# EAGLE design ISO-UART v0.1 (EAGLE 7.7.0)
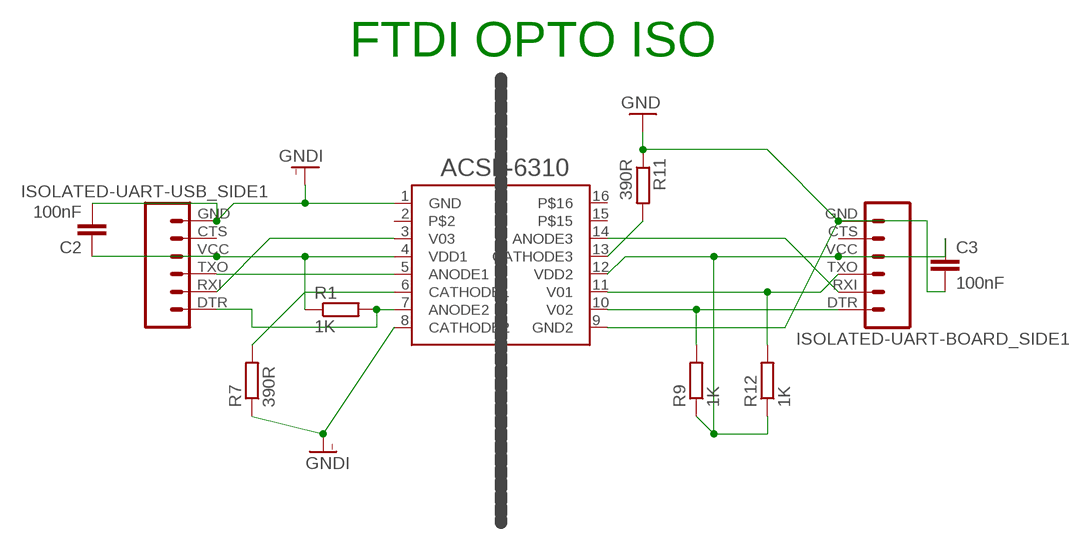
[diagram p0: schematic, sheet 1]

## Parts
ACSL-6310  ACSL-6310  [SO16]
C2  100nF  C-EUC0603  [C0603]
C3  100nF  C-EUC0603  [C0603]
ISOLATED-UART-BOARD_SIDE1  2211S-06G  FTDI_BASICPTH  [FTDI_BASIC]
ISOLATED-UART-USB_SIDE1  2211S-06G  FTDI_BASICPTH  [FTDI_BASIC]
R1  1K  R-EU_R0603  [R0603]
R7  390R  R-EU_R0603  [R0603]
R9  1K  R-EU_R0603  [R0603]
R11  390R  R-EU_R0603  [R0603]
R12  1K  R-EU_R0603  [R0603]

## Nets
GND [thin_power]: ACSL-6310.9(GND2) C3.2 ISOLATED-UART-BOARD_SIDE1.GND R11.1
GNDI [thin_power]: ACSL-6310.1(GND) ACSL-6310.8(CATHODE2) C2.2 ISOLATED-UART-USB_SIDE1.GND R7.1
N$2: ACSL-6310.4(VDD1) C2.1 ISOLATED-UART-USB_SIDE1.VCC R1.1
N$3: ACSL-6310.5(ANODE1) ISOLATED-UART-USB_SIDE1.TXO
N$4: ACSL-6310.7(ANODE2) ISOLATED-UART-USB_SIDE1.DTR R1.2
N$5: ACSL-6310.3(V03) ISOLATED-UART-USB_SIDE1.RXI
N$7: ACSL-6310.10(V02) ISOLATED-UART-BOARD_SIDE1.DTR R9.2
N$8 [thin_power]: ACSL-6310.12(VDD2) C3.1 ISOLATED-UART-BOARD_SIDE1.VCC R9.1 R12.1
N$9: ACSL-6310.14(ANODE3) ISOLATED-UART-BOARD_SIDE1.RXI
N$12: ACSL-6310.6(CATHODE1) R7.2
N$16: ACSL-6310.13(CATHODE3) R11.2
N$18: ACSL-6310.11(V01) ISOLATED-UART-BOARD_SIDE1.TXO R12.2
Unconnected: ACSL-6310.2 ACSL-6310.15 ACSL-6310.16 ISOLATED-UART-BOARD_SIDE1.CTS ISOLATED-UART-USB_SIDE1.CTS

## Notes on the sheet
- FTDI OPTO ISO
- ACSL-6310

## Library data of the parts
ACSL-6310 = PACKAGES FOR TEST BOARDS:ACSL-6310
C2 C3 = rcl:C-EU: CAPACITOR, European symbol
ISOLATED-UART-BOARD_SIDE1 ISOLATED-UART-USB_SIDE1 = SparkFun:FTDI_BASIC: FTDI Basic: 3.3V and 5V; MF: MULTICOMP; MPN: 2211S-06G; OC_FARNELL: 1593415
R1 R7 R9 R11 R12 = rcl:R-EU_: RESISTOR, European symbol

## Net classes
2 thin_power: width 0.254 mm

## Board
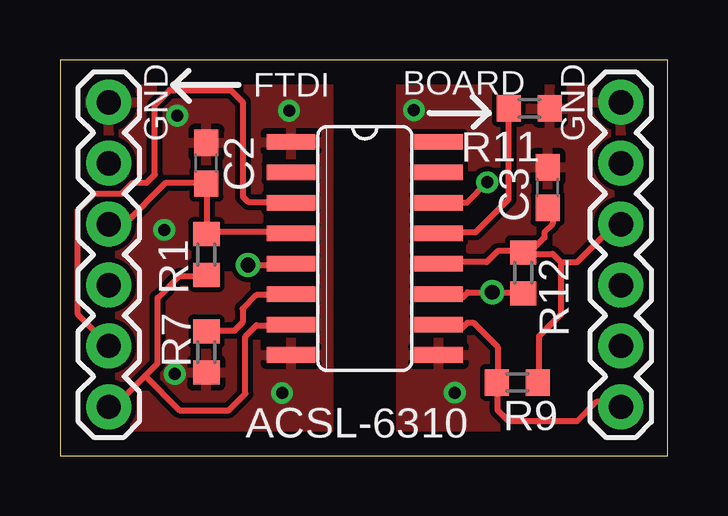
[diagram p1: board, top side]
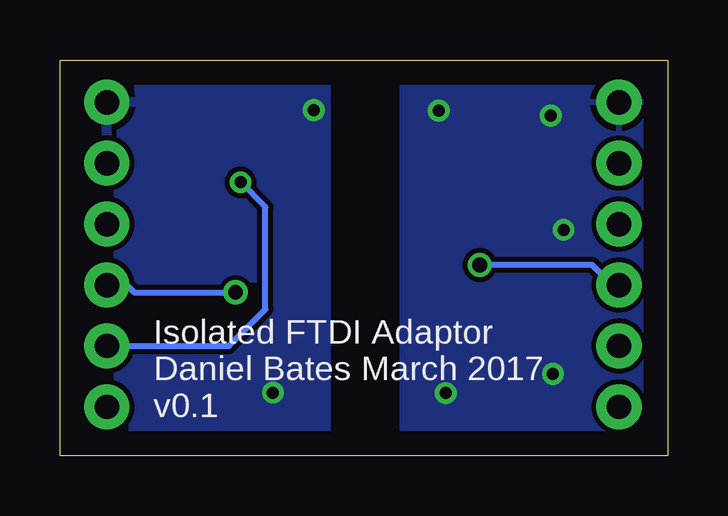
[diagram p2: board, bottom side, seen from below]

Size 25.32 x 16.5 mm. Coordinates in mm from the lower left corner, seen from the top.
Outline: 0,0 25.32,0 25.32,16.5 0,16.5 0,0
Copper layers (1*16): Top 0.035mm / dielectric 1.5mm / Bottom 0.035mm
Design rules "default": minimum track width 10mil, minimum drill 24mil, track to track 8mil, track to pad 8mil, pad to pad 8mil, via to via 8mil, smd to smd 8mil, copper to edge 40mil, drill to drill 8mil, minimum pad ring 10mil, minimum via ring 8mil, stop-mask expansion 4mil, vias tented up to drill 0mil, thermal gap 10mil

### Footprints (pad centres in the part's own frame; a part is rotated, then mirrored left to right if it is on the bottom)
SO16 = smd 0.66 x 2.032: 1 -4.445,-3.073; 2 -3.175,-3.073; 3 -1.905,-3.073; 4 -0.635,-3.073; 5 0.635,-3.073; 6 1.905,-3.073; 7 3.175,-3.073; 8 4.445,-3.073; 9 4.445,3.073; 10 3.175,3.073; 11 1.905,3.073; 12 0.635,3.073; 13 -0.635,3.073; 14 -1.905,3.073; 15 -3.175,3.073; 16 -4.445,3.073
C0603 = smd 1.1 x 1: 1 -0.85,0; 2 0.85,0
FTDI_BASIC = drill 1.016 pad 1.88: CTS 10.16,0; DTR 0,0; GND 12.7,0; RXI 2.54,0; TXO 5.08,0; VCC 7.62,0
R0603 = smd 1 x 1.1: 1 -0.85,0; 2 0.85,0

### Placement (x,y rotation side)
ACSL-6310  12.7,8.64 270 top
C2  6.1,12.19 90 top
C3  20.32,11.18 90 top
ISOLATED-UART-BOARD_SIDE1  23.37,2.03 90 top
ISOLATED-UART-USB_SIDE1  2.03,2.03 90 top
R1  6.1,8.38 270 top
R7  6.1,4.32 90 top
R9  19.05,3.05 180 top
R11  19.56,14.48 180 top
R12  19.3,7.62 270 top

### Tracks (layer width: path | path; a pad name or v marks a point on that pad's centre or on a via)
GND  (via drill 0.5)
  other vias: 14.75,14.41 16.45,2.62
  pour Bottom: 14.22,-0.51 14.22,17.27 25.91,17.27 25.91,-0.51
  pour Top: 14.22,-0.51 14.22,17.27 25.91,17.27 25.91,-0.51
GNDI  (via drill 0.5)
  other vias: 9.25,2.6 4.79,3.4 4.34,9.41 4.88,14.18 9.55,14.38
  pour Top: -0.51,-0.51 -0.51,17.27 11.18,17.27 11.18,-0.51
  pour Bottom: -0.51,-0.51 -0.51,17.27 11.18,17.27 11.18,-0.51
N$2
  Top 0.254: ACSL-6310.4 9.55,9.32 6.24,9.32 R1.1 6.12,9.32 6.12,11.27 C2.1 6.01,11.38 4.41,11.38 2.69,9.66 2.12,9.66 ISOLATED-UART-USB_SIDE1.VCC
N$3  (via drill 0.61)
  Top 0.254: v7.84,7.95 9.55,7.95 ACSL-6310.5
  Bottom 0.254: v7.84,7.95 3.15,7.95 2.35,7.15 2.12,7.15 ISOLATED-UART-USB_SIDE1.TXO
N$4
  Top 0.254: 3.55,3.32 2.35,2.12 2.12,2.12 ISOLATED-UART-USB_SIDE1.DTR | 3.55,3.32 4.06,3.83 4.06,6.58 4.98,7.49 6.01,7.49 R1.2 | 3.55,3.32 4.98,1.89 7.04,1.89 7.72,2.58 7.72,4.98 8.18,5.44 9.55,5.44 ACSL-6310.7
N$5
  Top 0.254: ACSL-6310.3 9.55,10.58 7.84,10.58 7.62,10.8 7.62,14.73 7.11,15.24 4.57,15.24 3.95,14.62 3.95,11.72 3.61,11.38 3.04,11.38 2.58,10.92 1.44,10.92 0.75,10.24 0.75,5.89 2.01,4.64 ISOLATED-UART-USB_SIDE1.RXI
N$7
  Top 0.254: ACSL-6310.10 15.84,5.44 15.95,5.32 16.75,5.32 16.98,5.55 17.21,5.55 18.24,4.52 18.24,3.15 R9.2 18.24,3.04 18.24,1.89 18.69,1.44 21.55,1.44 22.35,2.23 23.15,2.23 23.27,2.12 ISOLATED-UART-BOARD_SIDE1.DTR
N$8
  Top 0.254: R12.1 19.38,8.52 19.61,8.52 20.18,9.09 20.18,9.32 20.52,9.66 20.52,10.12 20.41,10.24 C3.1 | 20.87,8.06 20.87,5.89 19.95,4.98 19.95,3.15 R9.1 | 20.87,8.06 20.52,8.41 19.61,8.41 R12.1 | ACSL-6310.12 15.84,8.06 17.78,8.06 18.24,8.52 19.27,8.52 R12.1 | 20.87,8.06 21.55,8.06 23.04,9.55 23.27,9.55 ISOLATED-UART-BOARD_SIDE1.VCC
N$9  (via drill 0.5)
  Top 0.254: v17.8,11.4 16.94,10.54 ACSL-6310.14
  Bottom 0.254: ISOLATED-UART-BOARD_SIDE1.RXI 18.29,4.57 16.76,6.1 16.76,10.36 v17.8,11.4
N$12
  Top 0.254: R7.2 6.12,5.21 7.26,5.21 7.61,5.55 7.61,6.12 8.18,6.69 9.55,6.69 ACSL-6310.6
N$16
  Top 0.254: R11.2 18.69,14.46 18.69,10.69 17.32,9.32 15.84,9.32 ACSL-6310.13
N$18  (via drill 0.61)
  Top 0.254: R12.2 19.27,6.81 v18.01,6.81 16.98,6.81 16.75,6.58 15.95,6.58 15.84,6.69 ACSL-6310.11
  Bottom 0.254: v18.01,6.81 22.24,6.81 22.47,7.04 23.27,7.04 ISOLATED-UART-BOARD_SIDE1.TXO

### Text on the board
tNames: BOARD | FTDI | GND | GND
bNames: Isolated FTDI Adaptor / Daniel Bates March 2017 / v0.1